# Altium schematic sheet AFE and MOSFETs.SchDoc
size A4; SheetNumber: 7; SheetTotal: 7
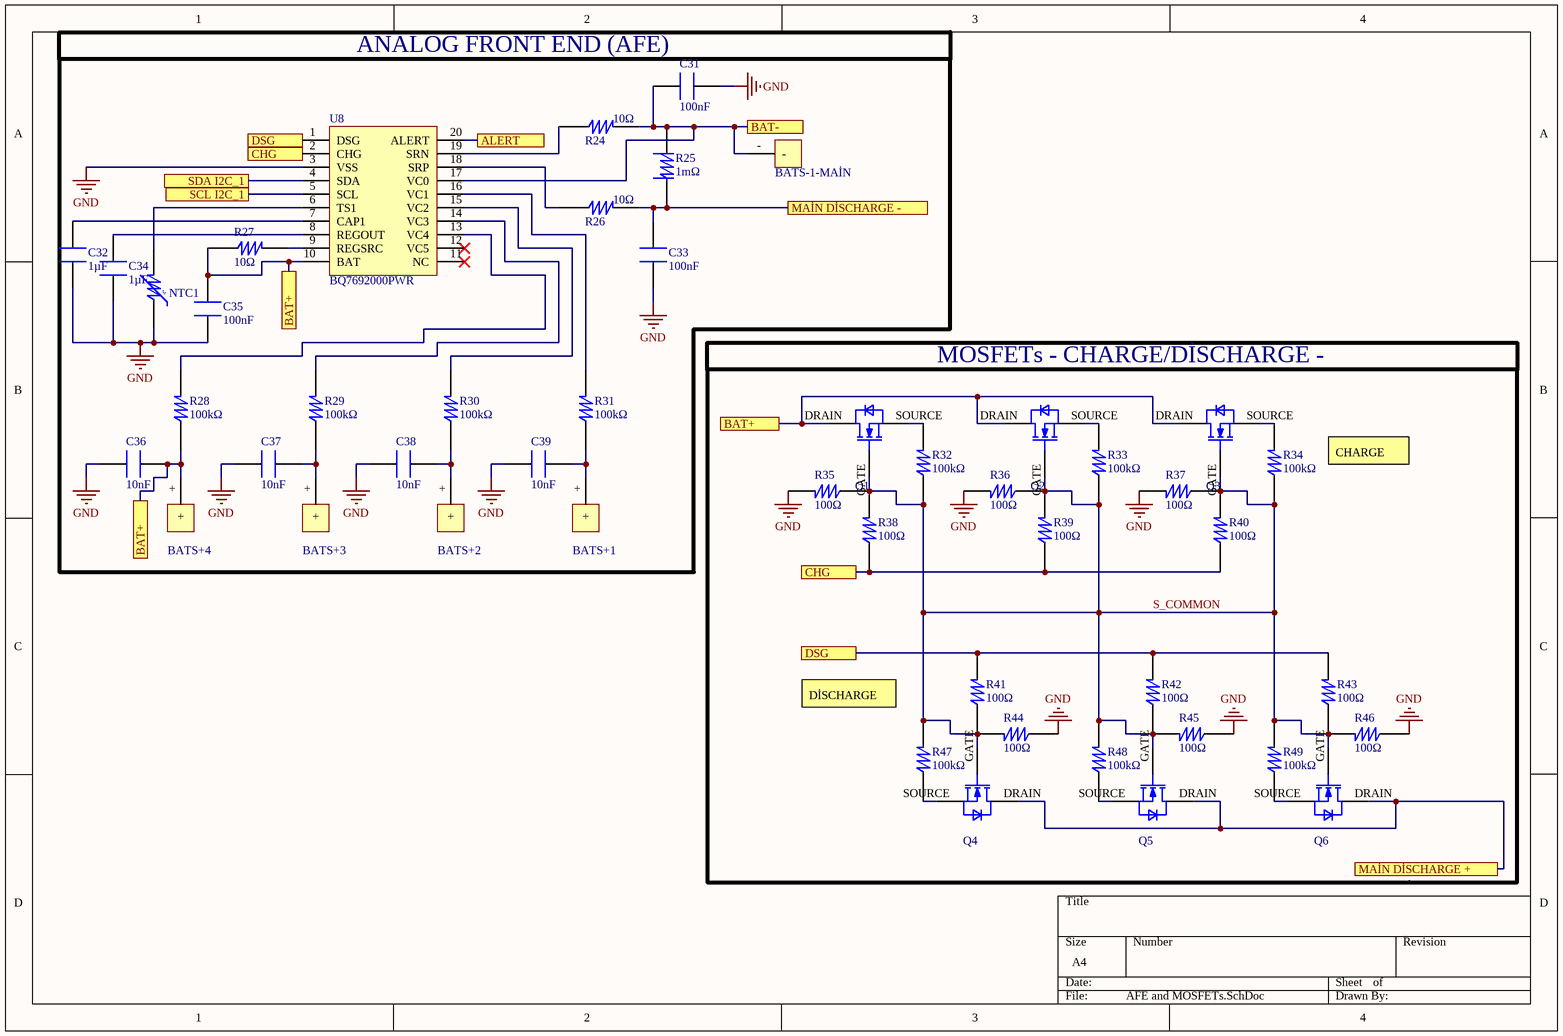
[diagram p0: AFE and MOSFETs.SchDoc]

## Parts
BATS+1  BATTERY + 1S  [BATTERY +1S]  (value not drawn)
BATS+2  BATTERY + 1S  [BATTERY +1S]  (value not drawn)
BATS+3  BATTERY + 1S  [BATTERY +1S]  (value not drawn)
BATS+4  BATTERY + 1S  [BATTERY +1S]  (value not drawn)
BATS-1-MAİN  BATTERY -1S  [BATTERY -1S]  (value not drawn)
C31  value 100nF  [CAP CER 0805]  (hidden comment: KGM21NR71H104KT)
C32  value 1µF  [CAP CER 0805]  (hidden comment: CL21B105KBFNNNE)
C33  value 100nF  [CAP CER 0805]  (hidden comment: KGM21NR71H104KT)
C34  value 1µF  [CAP CER 0805]  (hidden comment: CL21B105KBFNNNE)
C35  value 100nF  [CAP CER 0805]  (hidden comment: KGM21NR71H104KT)
C36  value 10nF  [CAP CER 0603]  (hidden comment: C0603C103J5RACTU)
C37  value 10nF  [CAP CER 0603]  (hidden comment: C0603C103J5RACTU)
C38  value 10nF  [CAP CER 0603]  (hidden comment: C0603C103J5RACTU)
C39  value 10nF  [CAP CER 0603]  (hidden comment: C0603C103J5RACTU)
NTC1  NC20KC0100KBA  [NTC 1206]  (value not drawn)
Q1  BSC010N04LSIATMA1  [8-PowerTDFN]  (value not drawn)
Q2  BSC010N04LSIATMA1  [8-PowerTDFN]  (value not drawn)
Q3  BSC010N04LSIATMA1  [8-PowerTDFN]  (value not drawn)
Q4  BSC010N04LSIATMA1  [8-PowerTDFN]  (value not drawn)
Q5  BSC010N04LSIATMA1  [8-PowerTDFN]  (value not drawn)
Q6  BSC010N04LSIATMA1  [8-PowerTDFN]  (value not drawn)
R24  value 10Ω  [RES 0603]  (hidden comment: RCP0603W10R0GEB)
R25  value 1mΩ  [Shunt 5931]  (hidden comment: SSA5931LR001FDR)
R26  value 10Ω  [RES 0603]  (hidden comment: RCP0603W10R0GEB)
R27  value 10Ω  [RES 0603]  (hidden comment: RT0603DRE0710RL)
R28  value 100kΩ  [RES 0603]  (hidden comment: RG1608P-104-B-T5)
R29  value 100kΩ  [RES 0603]  (hidden comment: RG1608P-104-B-T5)
R30  value 100kΩ  [RES 0603]  (hidden comment: RG1608P-104-B-T5)
R31  value 100kΩ  [RES 0603]  (hidden comment: RG1608P-104-B-T5)
R32  value 100kΩ  [RES 0603]  (hidden comment: RG1608P-104-B-T5)
R33  value 100kΩ  [RES 0603]  (hidden comment: RG1608P-104-B-T5)
R34  value 100kΩ  [RES 0603]  (hidden comment: RG1608P-104-B-T5)
R35  value 100Ω  [RES 0603]  (hidden comment: RG1608P-101-B-T5)
R36  value 100Ω  [RES 0603]  (hidden comment: RG1608P-101-B-T5)
R37  value 100Ω  [RES 0603]  (hidden comment: RG1608P-101-B-T5)
R38  value 100Ω  [RES 0603]  (hidden comment: RG1608P-101-B-T5)
R39  value 100Ω  [RES 0603]  (hidden comment: RG1608P-101-B-T5)
R40  value 100Ω  [RES 0603]  (hidden comment: RG1608P-101-B-T5)
R41  value 100Ω  [RES 0603]  (hidden comment: RG1608P-101-B-T5)
R42  value 100Ω  [RES 0603]  (hidden comment: RG1608P-101-B-T5)
R43  value 100Ω  [RES 0603]  (hidden comment: RG1608P-101-B-T5)
R44  value 100Ω  [RES 0603]  (hidden comment: RG1608P-101-B-T5)
R45  value 100Ω  [RES 0603]  (hidden comment: RG1608P-101-B-T5)
R46  value 100Ω  [RES 0603]  (hidden comment: RG1608P-101-B-T5)
R47  value 100kΩ  [RES 0603]  (hidden comment: RG1608P-104-B-T5)
R48  value 100kΩ  [RES 0603]  (hidden comment: RG1608P-104-B-T5)
R49  value 100kΩ  [RES 0603]  (hidden comment: RG1608P-104-B-T5)
U8  Supplier Part Number: BQ7692000PWR  [20-TSSOP]  (hidden comment: BQ7692000PW)

## Blocks framed on the sheet
ANALOG FRONT END (AFE): BATS+1-BATS+4 BATS-1-MAİN C31-C39 NTC1 R24-R31 U8
MOSFETs - CHARGE/DİSCHARGE -: Q1-Q6 R32-R49

## Ports
ALERT (see MCU[3A]), BAT+ (see AFE and MOSFETs[1B], AFE and MOSFETs[1C], Power[1C], Power[2A]), BAT+ (see AFE and MOSFETs[1B], AFE and MOSFETs[2B], Power[1C], Power[2A]), BAT+ (see AFE and MOSFETs[1C], AFE and MOSFETs[2B], Power[1C], Power[2A]), BAT- (see Power[1C]), CHG (see AFE and MOSFETs[1A]), CHG (see AFE and MOSFETs[3C]), DSG (see AFE and MOSFETs[1A]), DSG (see AFE and MOSFETs[3C]), MAİN DİSCHARGE + (see Power[1C]), MAİN DİSCHARGE - (see Power[1C]), SCL I2C_1 (see MCU[3B]), SDA I2C_1 (see MCU[2B])

## Nets
GND: C31.1 C32.2 C33.2 C34.2 C35.2 C36.1 C37.1 C38.1 C39.1 NTC1.1 R35.2 R36.2 R37.2 R44.1 R45.1 R46.1 U8.3(VSS)
ALERT: U8.20(ALERT) ; port ALERT
BAT+: BATS+4.+ C35.1 C36.2 Q1.DRAIN Q2.DRAIN Q3.DRAIN R27.1 R28.1 U8.10(BAT) ; port BAT+
BAT-: BATS-1-MAİN.- C31.2 R24.2 R25.2 U8.17(VC0) ; port BAT-
CHG: R38.1 R39.1 R40.1 U8.2(CHG) ; port CHG
DSG: R41.2 R42.2 R43.2 U8.1(DSG) ; port DSG
MAİN DİSCHARGE +: Q4.DRAIN Q5.DRAIN Q6.DRAIN ; port MAİN DİSCHARGE +
MAİN DİSCHARGE -: C33.1 R25.1 R26.2 ; port MAİN DİSCHARGE -
S_COMMON: Q1.GATE Q2.GATE Q3.GATE Q4.GATE Q5.GATE Q6.GATE R32.1 R33.1 R34.1 R35.1 R36.1 R37.1 R38.2 R39.2 R40.2 R41.1 R42.1 R43.1 R44.2 R45.2 R46.2 R47.2 R48.2 R49.2
SCL I2C_1: U8.5(SCL) ; port SCL I2C_1
SDA I2C_1: U8.4(SDA) ; port SDA I2C_1
NetBATS+1_+: BATS+1.+ C39.2 R31.1
NetBATS+2_+: BATS+2.+ C38.2 R30.1
NetBATS+3_+: BATS+3.+ C37.2 R29.1
NetC32_1: C32.1 U8.7(CAP1)
NetC34_1: C34.1 U8.8(REGOUT)
NetNTC1_2: NTC1.2 U8.6(TS1)
NetQ1_SOURCE: Q1.SOURCE R32.2
NetQ2_SOURCE: Q2.SOURCE R33.2
NetQ3_SOURCE: Q3.SOURCE R34.2
NetQ4_SOURCE: Q4.SOURCE R47.1
NetQ5_SOURCE: Q5.SOURCE R48.1
NetQ6_SOURCE: Q6.SOURCE R49.1
NetR24_1: R24.1 U8.19(SRN)
NetR26_1: R26.1 U8.18(SRP)
NetR27_2: R27.2 U8.9(REGSRC)
NetR28_2: R28.2 U8.13(VC4)
NetR29_2: R29.2 U8.14(VC3)
NetR30_2: R30.2 U8.15(VC2)
NetR31_2: R31.2 U8.16(VC1)

Not connected (* = marked no-connect by the designer): U8 11(NC)* 12(VC5)*

## Notes on the sheet
- CHARGE
- (near R47) DİSCHARGE
- (in symbol THERMISTOR NTC 10 OHM) -t°

## Library data of the parts
BATS+1-BATS+4 = BATTERY + 1S: battery + pad
BATS-1-MAİN = BATTERY -1S: battery - pad
C31 C33 C35 = CAP CER 0.1UF 50V 0805: 0.1 µF ±10% 50V Ceramic Capacitor X7R 0805 (2012 Metric); Manufacturer: KYOCERA AVX; Supplier: Arrow Electronics; Supplier Part Number: KGM21NR71H104KT; Manufacturer Part Number: KGM21NR71H104KT; RoHS: Compliant; Category: Ceramic Capacitors; Stock: 28652000; Pricing: 4000=0,0068, 20000=0,007, 100000=0,006 (USD); Dielectric Material: Ceramic; Height: 1mm; Length: 2.01mm; Lifecycle Status: Production; Max Operating Temperature: 125°C; Min Operating Temperature: -55°C; Mounting Technology: Surface Mount; Number of Terminals: 2; REACH SVHC: Yes; Voltage Rating (DC): 50V; Width: 1.25mm; ComponentLink1URL: https://datasheet.octopart.com:443/KGM21NR71H104KT-KYOCERA-AVX-datasheet-179280988.pdf?src-supplier=IHS; ComponentLink1Description: https://datasheet.octopart.com:443/KGM21NR71H104KT-KYOCERA-AVX-datasheet-179280988.pdf?src-supplier=IHS; ComponentLink2URL: https://datasheet.octopart.com:443/KGM21NR71H104KT-KYOCERA-AVX-datasheet-178027269.pdf?src-supplier=TME; ComponentLink2Description: https://datasheet.octopart.com:443/KGM21NR71H104KT-KYOCERA-AVX-datasheet-178027269.pdf?src-supplier=TME; ComponentLink3URL: https://datasheet.octopart.com:443/KGM21NR71H104KT-KYOCERA-AVX-datasheet-175509538.pdf?src-supplier=Future+Electronics; ComponentLink3Description: https://datasheet.octopart.com:443/KGM21NR71H104KT-KYOCERA-AVX-datasheet-175509538.pdf?src-supplier=Future+Electronics; ComponentLink4URL: http://sigma.octopart.com:80/conflict_mineral_statement/AVX-company-34.pdf?src-supplier=Compliance+Statements; ComponentLink4Description: http://sigma.octopart.com:80/conflict_mineral_statement/AVX-company-34.pdf?src-supplier=Compliance+Statements; ComponentLink5URL: http://sigma.octopart.com:80/reach_statement/AVX-company-19.pdf?src-supplier=Compliance+Statements; ComponentLink5Description: http://sigma.octopart.com:80/reach_statement/AVX-company-19.pdf?src-supplier=Compliance+Statements
C32 C34 = CAP CER 1UF 50V 0805: CAP CER 1UF 50V X7R 0805; Manufacturer: Samsung Electro-Mechanics; Dielectric Material: Ceramic; Tolerance: 10%; Supplier: Arrow Electronics; Supplier Part Number: CL21B105KBFNNNE; Manufacturer Part Number: CL21B105KBFNNNE; RoHS: Compliant; Category: Ceramic Capacitors; Stock: 4546000; Pricing: 10000=0,0106 (USD); Case/Package: 0805; Case Code (Imperial): 0805; Case Code (Metric): 2012; China RoHS: Compliant; Depth: 1.25mm; Dielectric: X7R; Height: 1.35mm; Length: 2mm; Lifecycle Status: Production; Material: Ceramic; Max Operating Temperature: 125°C; Min Operating Temperature: -55°C; Mounting Technology: Surface Mount; Number of Terminals: 2; Radiation Hardening: No; REACH SVHC: Yes; Schedule B: 8532240020, 8532240020|8532240020, 8532240020|8532240020|8532240020, 8532240020|8532240020|8532240020|8532240020; Thickness: 1.3462mm; Voltage: 50V; Voltage Rating: 50V; Voltage Rating (DC): 50V; Width: 1.25mm; ComponentLink1URL: https://datasheet.octopart.com:443/CL21B105KBFNNNE-Samsung-Electro-Mechanics-datasheet-136482495.pdf?src-supplier=IHS; ComponentLink1Description: https://datasheet.octopart.com:443/CL21B105KBFNNNE-Samsung-Electro-Mechanics-datasheet-136482495.pdf?src-supplier=IHS; ComponentLink2URL: https://datasheet.octopart.com:443/CL21B105KBFNNNE-Samsung-Electro-Mechanics-datasheet-11733377.pdf?src-supplier=Future+Electronics; ComponentLink2Description: https://datasheet.octopart.com:443/CL21B105KBFNNNE-Samsung-Electro-Mechanics-datasheet-11733377.pdf?src-supplier=Future+Electronics; ComponentLink3URL: https://datasheet.octopart.com:443/CL21B105KBFNNNE-Samsung-Electro-Mechanics-datasheet-116891038.pdf?src-supplier=Future+Electronics; ComponentLink3Description: https://datasheet.octopart.com:443/CL21B105KBFNNNE-Samsung-Electro-Mechanics-datasheet-116891038.pdf?src-supplier=Future+Electronics; ComponentLink4URL: https://datasheet.octopart.com:443/CL21B105KBFNNNE-Samsung-Electro-Mechanics-datasheet-81462183.pdf?src-supplier=Future+Electronics; ComponentLink4Description: https://datasheet.octopart.com:443/CL21B105KBFNNNE-Samsung-Electro-Mechanics-datasheet-81462183.pdf?src-supplier=Future+Electronics; ComponentLink5URL: https://datasheet.octopart.com:443/CL21B105KBFNNNE-Samsung-datasheet-48647582.pdf?src-supplier=Future+Electronics; ComponentLink5Description: https://datasheet.octopart.com:443/CL21B105KBFNNNE-Samsung-datasheet-48647582.pdf?src-supplier=Future+Electronics; ComponentLink6URL: https://datasheet.octopart.com:443/CL21B105KBFNNNE-Samsung-datasheet-8326294.pdf?src-supplier=Future+Electronics; ComponentLink6Description: https://datasheet.octopart.com:443/CL21B105KBFNNNE-Samsung-datasheet-8326294.pdf?src-supplier=Future+Electronics; ComponentLink7URL: https://datasheet.octopart.com:443/CL21B105KBFNNNE-Samsung-Electro-Mechanics-datasheet-149045959.pdf?src-supplier=Future+Electronics; ComponentLink7Description: https://datasheet.octopart.com:443/CL21B105KBFNNNE-Samsung-Electro-Mechanics-datasheet-149045959.pdf?src-supplier=Future+Electronics; ComponentLink8URL: https://datasheet.octopart.com/CL21B105KBFNNNE-Samsung-Electro-Mechanics-datasheet-97040617.pdf; ComponentLink8Description: https://datasheet.octopart.com/CL21B105KBFNNNE-Samsung-Electro-Mechanics-datasheet-97040617.pdf; ComponentLink9URL: https://datasheet.octopart.com/CL21B105KBFNNNE-Samsung-Electro-Mechanics-datasheet-8324245.pdf; ComponentLink9Description: https://datasheet.octopart.com/CL21B105KBFNNNE-Samsung-Electro-Mechanics-datasheet-8324245.pdf; ComponentLink10URL: https://datasheet.octopart.com/General-Multilayer-Ceramic-Capacitors-Samsung-datasheet-family-111.pdf; ComponentLink10Description: https://datasheet.octopart.com/General-Multilayer-Ceramic-Capacitors-Samsung-datasheet-family-111.pdf; ComponentLink11URL: https://datasheet.octopart.com:443/CL21B105KBFNNNE-Samsung-datasheet-59220082.pdf?src-supplier=TME; ComponentLink11Description: https://datasheet.octopart.com:443/CL21B105KBFNNNE-Samsung-datasheet-59220082.pdf?src-supplier=TME; ComponentLink12URL: http://sigma.octopart.com:80/rohs_certificate/General-Multilayer-Ceramic-Capacitors-Samsung-family-110.pdf?src-supplier=Compliance+Statements; ComponentLink12Description: http://sigma.octopart.com:80/rohs_certificate/General-Multilayer-Ceramic-Capacitors-Samsung-family-110.pdf?src-supplier=Compliance+Statements; ComponentLink13URL: http://sigma.octopart.com:80/rohs_statement/General-Multilayer-Ceramic-Capacitors-Samsung-family-132.pdf?src-supplier=Compliance+Statements; ComponentLink13Description: http://sigma.octopart.com:80/rohs_statement/General-Multilayer-Ceramic-Capacitors-Samsung-family-132.pdf?src-supplier=Compliance+Statements; ComponentLink14URL: http://sigma.octopart.com:80/reach_statement/General-Multilayer-Ceramic-Capacitors-Samsung-family-133.pdf?src-supplier=Compliance+Statements; ComponentLink14Description: http://sigma.octopart.com:80/reach_statement/General-Multilayer-Ceramic-Capacitors-Samsung-family-133.pdf?src-supplier=Compliance+Statements
C36-C39 = CAP CER 0.01µF (10 nF) 50V 0603: CAP CER 10000PF 50V X7R 0603; Manufacturer: KEMET; Dielectric Material: Ceramic; Dissipation Factor: 2.5%; Temperature Coefficient: 30ppm/°C; Tolerance: 5%; Supplier: Arrow Electronics; Supplier Part Number: C0603C103J5RACTU; Manufacturer Part Number: C0603C103J5RACTU; RoHS: Compliant; Category: Ceramic Capacitors; Stock: 896000; Pricing: 20000=0,0043 (USD); Case/Package: 0603; Case Code (Imperial): 0603; China RoHS: Compliant; Contact Plating: Tin; Depth: 800µm; Dielectric: X7R; Height: 800µm; Lead Free: Lead Free; Lead Pitch: 700µm; Length: 1.6mm; Lifecycle Status: Production; Material: Ceramic; Max Operating Temperature: 125°C; Min Operating Temperature: -55°C; Mounting Technology: Surface Mount; Pins: 2; Number of Terminals: 2; Packaging: Cut Tape; Radiation Hardening: No; REACH SVHC: Yes; Schedule B: 8532240020, 8532240020|8532240020, 8532240020|8532240020|8532240020, 8532240020|8532240020|8532240020|8532240020; Termination: SMD/SMT; Thickness: 863.6µm; Voltage: 50V; Voltage Rating: 50V; Voltage Rating (DC): 50V; Width: 800µm; ComponentLink1URL: https://datasheet.octopart.com:443/C0603C103J5RAC7867-KEMET-datasheet-179096189.pdf?src-supplier=IHS; ComponentLink1Description: https://datasheet.octopart.com:443/C0603C103J5RAC7867-KEMET-datasheet-179096189.pdf?src-supplier=IHS; ComponentLink2URL: https://datasheet.octopart.com:443/C0603C103J5RACTU-KEMET-datasheet-178445679.pdf?src-supplier=IHS; ComponentLink2Description: https://datasheet.octopart.com:443/C0603C103J5RACTU-KEMET-datasheet-178445679.pdf?src-supplier=IHS; ComponentLink3URL: https://datasheet.octopart.com:443/C0603C103J5RACTU-KEMET-datasheet-137357759.pdf?src-supplier=Upverter; ComponentLink3Description: https://datasheet.octopart.com:443/C0603C103J5RACTU-KEMET-datasheet-137357759.pdf?src-supplier=Upverter; ComponentLink4URL: https://datasheet.octopart.com:443/C0603C103J5RACTU-KEMET-datasheet-137357764.pdf?src-supplier=Upverter; ComponentLink4Description: https://datasheet.octopart.com:443/C0603C103J5RACTU-KEMET-datasheet-137357764.pdf?src-supplier=Upverter; ComponentLink5URL: https://datasheet.octopart.com:443/C0603C103J5RAC-TU-Kemet-datasheet-5313890.pdf?src-supplier=Newark; ComponentLink5Description: https://datasheet.octopart.com:443/C0603C103J5RAC-TU-Kemet-datasheet-5313890.pdf?src-supplier=Newark; ComponentLink6URL: https://datasheet.octopart.com:443/C0603C103J5RAC-TU-Kemet-datasheet-5390537.pdf?src-supplier=Newark; ComponentLink6Description: https://datasheet.octopart.com:443/C0603C103J5RAC-TU-Kemet-datasheet-5390537.pdf?src-supplier=Newark; ComponentLink7URL: https://datasheet.octopart.com:443/C0603C103J5RAC-TU-Kemet-datasheet-7541751.pdf?src-supplier=Newark; ComponentLink7Description: https://datasheet.octopart.com:443/C0603C103J5RAC-TU-Kemet-datasheet-7541751.pdf?src-supplier=Newark; ComponentLink8URL: https://datasheet.octopart.com:443/C0603C103J5RACTU-KEMET-datasheet-176289383.pdf?src-supplier=Newark; ComponentLink8Description: https://datasheet.octopart.com:443/C0603C103J5RACTU-KEMET-datasheet-176289383.pdf?src-supplier=Newark; ComponentLink9URL: https://datasheet.octopart.com:443/C0603C103J5RACTU-KEMET-datasheet-130256537.pdf?src-supplier=Newark; ComponentLink9Description: https://datasheet.octopart.com:443/C0603C103J5RACTU-KEMET-datasheet-130256537.pdf?src-supplier=Newark; ComponentLink10URL: https://datasheet.octopart.com:443/C0603C103J5RACTU-Kemet-datasheet-8764837.pdf?src-supplier=Newark; ComponentLink10Description: https://datasheet.octopart.com:443/C0603C103J5RACTU-Kemet-datasheet-8764837.pdf?src-supplier=Newark; ComponentLink11URL: https://datasheet.octopart.com:443/C0603C103J5RACTU-Kemet-datasheet-8480123.pdf?src-supplier=Newark; ComponentLink11Description: https://datasheet.octopart.com:443/C0603C103J5RACTU-Kemet-datasheet-8480123.pdf?src-supplier=Newark; ComponentLink12URL: https://datasheet.octopart.com:443/C0603C103J5RACTU-Kemet-datasheet-5393970.pdf?src-supplier=Newark; ComponentLink12Description: https://datasheet.octopart.com:443/C0603C103J5RACTU-Kemet-datasheet-5393970.pdf?src-supplier=Newark; ComponentLink13URL: https://datasheet.octopart.com:443/C0603C103J5RACTU-Kemet-datasheet-8502025.pdf?src-supplier=Newark; ComponentLink13Description: https://datasheet.octopart.com:443/C0603C103J5RACTU-Kemet-datasheet-8502025.pdf?src-supplier=Newark; ComponentLink14URL: https://datasheet.octopart.com:443/C0603C103J5RACTU-Kemet-datasheet-161801.pdf?src-supplier=Newark; ComponentLink14Description: https://datasheet.octopart.com:443/C0603C103J5RACTU-Kemet-datasheet-161801.pdf?src-supplier=Newark; ComponentLink15URL: https://datasheet.octopart.com:443/C0603C103J5RACTU-KEMET-datasheet-149521810.pdf?src-supplier=Farnell; ComponentLink15Description: https://datasheet.octopart.com:443/C0603C103J5RACTU-KEMET-datasheet-149521810.pdf?src-supplier=Farnell; ComponentLink16URL: https://datasheet.octopart.com:443/C0603C103J5RACTU-Kemet-datasheet-12608295.pdf?src-supplier=Farnell; ComponentLink16Description: https://datasheet.octopart.com:443/C0603C103J5RACTU-Kemet-datasheet-12608295.pdf?src-supplier=Farnell; ComponentLink17URL: https://datasheet.octopart.com:443/C0603C103J5RACTU-Kemet-datasheet-11992184.pdf?src-supplier=Farnell; ComponentLink17Description: https://datasheet.octopart.com:443/C0603C103J5RACTU-Kemet-datasheet-11992184.pdf?src-supplier=Farnell; ComponentLink18URL: https://datasheet.octopart.com:443/C0603C103J5RACTU-Kemet-datasheet-10942409.pdf?src-supplier=Farnell; ComponentLink18Description: https://datasheet.octopart.com:443/C0603C103J5RACTU-Kemet-datasheet-10942409.pdf?src-supplier=Farnell; ComponentLink19URL: https://datasheet.octopart.com:443/C0603C103J5RACTU-Kemet-datasheet-10404442.pdf?src-supplier=Farnell; ComponentLink19Description: https://datasheet.octopart.com:443/C0603C103J5RACTU-Kemet-datasheet-10404442.pdf?src-supplier=Farnell; ComponentLink20URL: https://datasheet.octopart.com:443/C0603C103J5RACTU-KEMET-datasheet-101575638.pdf?src-supplier=Farnell; ComponentLink20Description: https://datasheet.octopart.com:443/C0603C103J5RACTU-KEMET-datasheet-101575638.pdf?src-supplier=Farnell; ComponentLink21URL: https://datasheet.octopart.com:443/C0603C103J5RAC-TU-Kemet-datasheet-7833651.pdf?src-supplier=Farnell; ComponentLink21Description: https://datasheet.octopart.com:443/C0603C103J5RAC-TU-Kemet-datasheet-7833651.pdf?src-supplier=Farnell; ComponentLink22URL: https://datasheet.octopart.com:443/C0603C103J5RAC-TU-Kemet-datasheet-7601896.pdf?src-supplier=Farnell; ComponentLink22Description: https://datasheet.octopart.com:443/C0603C103J5RAC-TU-Kemet-datasheet-7601896.pdf?src-supplier=Farnell; ComponentLink23URL: https://datasheet.octopart.com:443/C0603C103J5RAC-TU-Kemet-datasheet-5316294.pdf?src-supplier=Farnell; ComponentLink23Description: https://datasheet.octopart.com:443/C0603C103J5RAC-TU-Kemet-datasheet-5316294.pdf?src-supplier=Farnell; ComponentLink24URL: https://datasheet.octopart.com:443/C0603C103J5RAC-TU-Kemet-datasheet-5314837.pdf?src-supplier=Farnell; ComponentLink24Description: https://datasheet.octopart.com:443/C0603C103J5RAC-TU-Kemet-datasheet-5314837.pdf?src-supplier=Farnell; ComponentLink25URL: https://datasheet.octopart.com:443/C0603C103J5RAC-TU-Kemet-datasheet-8092359.pdf?src-supplier=Farnell; ComponentLink25Description: https://datasheet.octopart.com:443/C0603C103J5RAC-TU-Kemet-datasheet-8092359.pdf?src-supplier=Farnell; ComponentLink26URL: https://datasheet.octopart.com:443/C0603C103J5RAC-TU-Kemet-datasheet-5314449.pdf?src-supplier=Farnell; ComponentLink26Description: https://datasheet.octopart.com:443/C0603C103J5RAC-TU-Kemet-datasheet-5314449.pdf?src-supplier=Farnell; ComponentLink27URL: https://datasheet.octopart.com:443/C0603C103J5RAC-TU-Kemet-datasheet-5314969.pdf?src-supplier=Farnell; ComponentLink27Description: https://datasheet.octopart.com:443/C0603C103J5RAC-TU-Kemet-datasheet-5314969.pdf?src-supplier=Farnell; ComponentLink28URL: https://datasheet.octopart.com:443/C0603C103J5RAC-TU-Kemet-datasheet-5314627.pdf?src-supplier=Farnell; ComponentLink28Description: https://datasheet.octopart.com:443/C0603C103J5RAC-TU-Kemet-datasheet-5314627.pdf?src-supplier=Farnell; ComponentLink29URL: https://datasheet.octopart.com:443/C0603C103J5RAC-TU-Kemet-datasheet-5389132.pdf?src-supplier=Farnell; ComponentLink29Description: https://datasheet.octopart.com:443/C0603C103J5RAC-TU-Kemet-datasheet-5389132.pdf?src-supplier=Farnell; ComponentLink30URL: https://datasheet.octopart.com:443/C0603C103J5RAC-TU-Kemet-datasheet-5313836.pdf?src-supplier=Farnell; ComponentLink30Description: https://datasheet.octopart.com:443/C0603C103J5RAC-TU-Kemet-datasheet-5313836.pdf?src-supplier=Farnell; ComponentLink31URL: https://datasheet.octopart.com:443/C0603C103J5RAC-TU-Kemet-datasheet-8111010.pdf?src-supplier=Farnell; ComponentLink31Description: https://datasheet.octopart.com:443/C0603C103J5RAC-TU-Kemet-datasheet-8111010.pdf?src-supplier=Farnell; ComponentLink32URL: https://datasheet.octopart.com:443/C0603C103J5RAC-TU-Kemet-datasheet-7627733.pdf?src-supplier=Farnell; ComponentLink32Description: https://datasheet.octopart.com:443/C0603C103J5RAC-TU-Kemet-datasheet-7627733.pdf?src-supplier=Farnell; ComponentLink33URL: https://datasheet.octopart.com:443/C0603C103J5RAC-TU-Kemet-datasheet-5315946.pdf?src-supplier=Farnell; ComponentLink33Description: https://datasheet.octopart.com:443/C0603C103J5RAC-TU-Kemet-datasheet-5315946.pdf?src-supplier=Farnell; ComponentLink34URL: https://datasheet.octopart.com:443/C0603C103J5RACTU-Kemet-datasheet-32036385.pdf?src-supplier=Electro+Sonic; ComponentLink34Description: https://datasheet.octopart.com:443/C0603C103J5RACTU-Kemet-datasheet-32036385.pdf?src-supplier=Electro+Sonic; ComponentLink35URL: https://datasheet.octopart.com:443/C0603C103J5RACTU-KEMET-datasheet-157246124.pdf?src-supplier=Electro+Sonic; ComponentLink35Description: https://datasheet.octopart.com:443/C0603C103J5RACTU-KEMET-datasheet-157246124.pdf?src-supplier=Electro+Sonic; ComponentLink36URL: https://datasheet.octopart.com:443/C0603C103J5RACTU-KEMET-datasheet-164512540.pdf?src-supplier=TME; ComponentLink36Description: https://datasheet.octopart.com:443/C0603C103J5RACTU-KEMET-datasheet-164512540.pdf?src-supplier=TME; ComponentLink37URL: https://datasheet.octopart.com:443/C0603C103J5RACTU-KEMET-datasheet-96931484.pdf?src-supplier=TME; ComponentLink37Description: https://datasheet.octopart.com:443/C0603C103J5RACTU-KEMET-datasheet-96931484.pdf?src-supplier=TME; ComponentLink38URL: https://datasheet.octopart.com:443/C0603C103J5RACTU-KEMET-datasheet-68331906.pdf?src-supplier=TME; ComponentLink38Description: https://datasheet.octopart.com:443/C0603C103J5RACTU-KEMET-datasheet-68331906.pdf?src-supplier=TME; ComponentLink39URL: https://datasheet.octopart.com:443/C0603C103J5RACTU-KEMET-datasheet-160663178.pdf?src-supplier=JRH+Electronics; ComponentLink39Description: https://datasheet.octopart.com:443/C0603C103J5RACTU-KEMET-datasheet-160663178.pdf?src-supplier=JRH+Electronics; ComponentLink40URL: https://datasheet.octopart.com:443/C0603C103J5RACTU-KEMET-datasheet-110724412.pdf?src-supplier=RS+(Formerly+Allied+Electronics); ComponentLink40Description: https://datasheet.octopart.com:443/C0603C103J5RACTU-KEMET-datasheet-110724412.pdf?src-supplier=RS+(Formerly+Allied+Electronics); ComponentLink41URL: https://datasheet.octopart.com:443/C0603C103J5RACTU-Kemet-datasheet-464.pdf?src-supplier=RS+(Formerly+Allied+Electronics); ComponentLink41Description: https://datasheet.octopart.com:443/C0603C103J5RACTU-Kemet-datasheet-464.pdf?src-supplier=RS+(Formerly+Allied+Electronics); ComponentLink42URL: https://datasheet.octopart.com/C0603C103J5RACTU-KEMET-datasheet-84169754.pdf; ComponentLink42Description: https://datasheet.octopart.com/C0603C103J5RACTU-KEMET-datasheet-84169754.pdf; ComponentLink43URL: https://datasheet.octopart.com:443/C0603C103J5RACTU-Kemet-datasheet-24570007.pdf?src-supplier=element14+APAC; ComponentLink43Description: https://datasheet.octopart.com:443/C0603C103J5RACTU-Kemet-datasheet-24570007.pdf?src-supplier=element14+APAC; ComponentLink44URL: https://datasheet.octopart.com:443/C0603C103J5RACTU-Kemet-datasheet-22084244.pdf?src-supplier=element14+APAC; ComponentLink44Description: https://datasheet.octopart.com:443/C0603C103J5RACTU-Kemet-datasheet-22084244.pdf?src-supplier=element14+APAC; ComponentLink45URL: https://datasheet.octopart.com:443/C0603C103J5RACTU-Kemet-datasheet-11807495.pdf?src-supplier=Arrow+Electronics; ComponentLink45Description: https://datasheet.octopart.com:443/C0603C103J5RACTU-Kemet-datasheet-11807495.pdf?src-supplier=Arrow+Electronics; ComponentLink46URL: https://datasheet.octopart.com:443/C0603C103J5RAC-TU-Kemet-datasheet-7275486.pdf?src-supplier=Jameco; ComponentLink46Description: https://datasheet.octopart.com:443/C0603C103J5RAC-TU-Kemet-datasheet-7275486.pdf?src-supplier=Jameco
NTC1 = THERMISTOR NTC 10 OHM: NTC Thermistor 10 1206 (3216 Metric); Manufacturer: KYOCERA AVX; Accuracy: 5%; Max Power Dissipation: 240mW; Value: 10Ω NTC; Tolerance: 10%; Supplier: Mouser; Supplier Part Number: 581-NC20KC0100KBA; Manufacturer Part Number: NC20KC0100KBA; RoHS: Compliant; Category: Thermistors; Stock: 13105; Pricing: 1=0,43, 10=0,405, 50=0,359, 100=0,342, 1000=0,295, 10000=0,282 (USD); Case/Package: 1206; Case Code (Imperial): 1206; Case Code (Metric): 3216; China RoHS: Compliant; Depth: 1.6mm; Height: 1.5mm; Lead Free: Contains Lead; Length: 3.2mm; Lifecycle Status: Production; Max Operating Temperature: 150°C; Min Operating Temperature: -55°C; Mounting Technology: Surface Mount; Pins: 2; Number of Terminals: 2; Power Dissipation: 240mW; Power Rating: 240mW; Radiation Hardening: No; REACH SVHC: Yes; Schedule B: 8533400080; Termination: SMD/SMT; Width: 1.6mm; ComponentLink1URL: https://datasheet.octopart.com:443/NC20KC0100KBA-KYOCERA-AVX-datasheet-182025368.pdf?src-supplier=IHS; ComponentLink1Description: https://datasheet.octopart.com:443/NC20KC0100KBA-KYOCERA-AVX-datasheet-182025368.pdf?src-supplier=IHS; ComponentLink2URL: https://datasheet.octopart.com:443/NC20KC0100KBA-AVX-datasheet-2691.pdf?src-supplier=Mouser; ComponentLink2Description: https://datasheet.octopart.com:443/NC20KC0100KBA-AVX-datasheet-2691.pdf?src-supplier=Mouser; ComponentLink3URL: https://datasheet.octopart.com:443/NC20KC0100KBA-AVX-datasheet-12341000.pdf?src-supplier=_legacy+Avnet; ComponentLink3Description: https://datasheet.octopart.com:443/NC20KC0100KBA-AVX-datasheet-12341000.pdf?src-supplier=_legacy+Avnet; ComponentLink4URL: http://sigma.octopart.com:80/conflict_mineral_statement/AVX-company-34.pdf?src-supplier=Compliance+Statements; ComponentLink4Description: http://sigma.octopart.com:80/conflict_mineral_statement/AVX-company-34.pdf?src-supplier=Compliance+Statements; ComponentLink5URL: http://sigma.octopart.com:80/reach_statement/AVX-company-19.pdf?src-supplier=Compliance+Statements; ComponentLink5Description: http://sigma.octopart.com:80/reach_statement/AVX-company-19.pdf?src-supplier=Compliance+Statements
Q1-Q6 = MOSFET N-CH 40V 37A/100A: N-Channel 40 V 37A (Ta), 100A (Tc) 2.5W (Ta), 139W (Tc) Surface Mount PG-TDSON-8 FL; Manufacturer: Infineon; Drain to Source Breakdown Voltage: 40V; Drain to Source Resistance: 1.4mΩ; Fall Time: 17ns; Gate to Source Voltage (Vgs): 20V; Input Capacitance: 6.2nF; Max Junction Temperature (Tj): 150°C; Number of Channels: 1; On-State Resistance: 1.05mΩ; Rise Time: 48ns; Turn-Off Delay Time: 33ns; Turn-On Delay Time: 9ns; Supplier: Farnell; Supplier Part Number: 2725801; Manufacturer Part Number: BSC010N04LSIATMA1; RoHS: Compliant; Category: MOSFETs; Stock: 11576; Pricing: 1=1,27, 10=1,13, 100=1,12, 500=0,92, 1000=0,818 (EUR); China RoHS: Non-Compliant; Continuous Drain Current (ID): 37A; Drain to Source Voltage (Vdss): 40V; Halogen Free: Halogen Free; Height: 1.1mm; Lead Free: Contains Lead; Lifecycle Status: Production; Max Dual Supply Voltage: 40V; Max Operating Temperature: 150°C; Max Power Dissipation: 139W; Min Breakdown Voltage: 40V; Min Operating Temperature: -55°C; Mounting Technology: Surface Mount; Number of Elements: 1; Pins: 8; Number of Terminals: 8; Package Quantity: 5000; Packaging: Tape & Reel; Power Dissipation: 2.5W; Rds On Max: 1.05mΩ; REACH SVHC: No; Schedule B: 8541290080, 8541290080|8541290080|8541290080|8541290080|8541290080|8541290080|8541290080|8541290080|8541290080|8541290080|8541290080|8541290080|8541290080|8541290080|8541290080|8541290080|8541290080|8541290080|8541290080|8541290080|8541290080|8541290080|8541290080|85; ComponentLink1URL: https://datasheet.octopart.com:443/BSC010N04LSIATMA1-Infineon-datasheet-82520598.pdf?src-supplier=ODG+(Origin+Data+Global); ComponentLink1Description: https://datasheet.octopart.com:443/BSC010N04LSIATMA1-Infineon-datasheet-82520598.pdf?src-supplier=ODG+(Origin+Data+Global); ComponentLink2URL: https://datasheet.octopart.com:443/BSC010N04LSIATMA1-Infineon-datasheet-62293607.pdf?src-supplier=TME; ComponentLink2Description: https://datasheet.octopart.com:443/BSC010N04LSIATMA1-Infineon-datasheet-62293607.pdf?src-supplier=TME; ComponentLink3URL: http://sigma.octopart.com:80/conflict_mineral_statement/Infineon-company-51.pdf?src-supplier=Compliance+Statements; ComponentLink3Description: http://sigma.octopart.com:80/conflict_mineral_statement/Infineon-company-51.pdf?src-supplier=Compliance+Statements
R24 R26 = RES 10 OHM 1.5W 0603: 10 Ohms ±2% 1.5W Chip Resistor 0603 (1608 Metric) Moisture Resistant Thick Film; Manufacturer: Vishay; Max Power Dissipation: 3.9W; Temperature Coefficient: 150ppm/°C; Working Voltage: 3.873V; Supplier: Arrow Electronics; Supplier Part Number: RCP0603W10R0GEB; Manufacturer Part Number: RCP0603W10R0GEB; RoHS: Compliant; Category: Chip SMD Resistors; Pricing: 1000=1,5971 (USD); Case/Package: 0603; Composition: Thick Film; Features: Moisture Resistant; Height: 460µm; Length: 1.6002mm; Lifecycle Status: Production; Max Operating Temperature: 155°C; Min Operating Temperature: -65°C; Mounting Technology: Surface Mount; Number of Terminals: 2; Number of Terminations: 2; Power Dissipation: 1.5W; Power Rating: 1.5W; Tolerance: 2%; Width: 810µm; ComponentLink1URL: https://datasheet.octopart.com:443/RCP0603W10R0GEB-Vishay-datasheet-182028431.pdf?src-supplier=IHS; ComponentLink1Description: https://datasheet.octopart.com:443/RCP0603W10R0GEB-Vishay-datasheet-182028431.pdf?src-supplier=IHS; ComponentLink2URL: https://datasheet.octopart.com:443/RCP0603W10R0GEB-Vishay-datasheet-152607319.pdf?src-supplier=Upverter; ComponentLink2Description: https://datasheet.octopart.com:443/RCP0603W10R0GEB-Vishay-datasheet-152607319.pdf?src-supplier=Upverter; ComponentLink3URL: http://sigma.octopart.com:80/rohs_statement/Vishay-company-15.pdf?src-supplier=Compliance+Statements; ComponentLink3Description: http://sigma.octopart.com:80/rohs_statement/Vishay-company-15.pdf?src-supplier=Compliance+Statements
R25 = RES SHUNT 1 mOHM 10W: 10W Chip Resistor Nonstandard Current Sense, High Voltage Metal Element; Manufacturer: Littelfuse; Temperature Coefficient: 50ppm/°C; Tolerance: 1%; Supplier: Mouser; Supplier Part Number: 576-SSA5931LR001FDR; Manufacturer Part Number: SSA5931LR001FDR; RoHS: Compliant; Category: Chip SMD Resistors; Stock: 1410; Pricing: 1=1,96, 10=1,3, 50=1,01, 100=0,909, 1000=0,677, 10000=0,611 (USD); Height: 500µm; Lifecycle Status: Production; Max Operating Temperature: 170°C; Min Operating Temperature: -55°C; Mounting Technology: Surface Mount; Number of Terminals: 2; Power Dissipation: 10W; Width: 7.75mm; ComponentLink1URL: https://datasheet.octopart.com:443/SSA5931LR001FDR-Littelfuse-datasheet-182144187.pdf?src-supplier=IHS; ComponentLink1Description: https://datasheet.octopart.com:443/SSA5931LR001FDR-Littelfuse-datasheet-182144187.pdf?src-supplier=IHS
R27 = RES 10 OHM 1/10W 0603: 10 Ohms ±0.5% 0.1W, 1/10W Chip Resistor 0603 (1608 Metric) Thin Film; Manufacturer: Yageo Group; Max Power Dissipation: 100mW; Temperature Coefficient: 50ppm/°C; Voltage Rating: 75V; Voltage Rating (DC): 50V; Supplier: Farnell; Supplier Part Number: 4013877; Manufacturer Part Number: RT0603DRE0710RL; RoHS: Compliant; Category: Chip SMD Resistors; Stock: 4780; Pricing: 10=0,0244, 100=0,018, 500=0,0165, 1000=0,015, 2500=0,0135, 5000=0,012 (EUR); Case/Package: 0603; Case Code (Imperial): 0603; China RoHS: Non-Compliant; Composition: Thin Film; Contact Plating: Tin; Features: Moisture Resistant; Height: 450µm; Lead Free: Lead Free; Length: 1.6002mm; Lifecycle Status: Production; Max Operating Temperature: 155°C; Min Operating Temperature: -55°C; Mounting Technology: Surface Mount; Number of Terminals: 2; Number of Terminations: 2; Packaging: Tape & Reel (TR); Power Dissipation: 100mW; Power Rating: 100mW; Radiation Hardening: No; REACH SVHC: Yes; Tolerance: 0.5%; Width: 800µm; Working Voltage: 75V; ComponentLink1URL: https://datasheet.octopart.com:443/RT0603DRE0710RL-Yageo-datasheet-176402239.pdf?src-supplier=Newark; ComponentLink1Description: https://datasheet.octopart.com:443/RT0603DRE0710RL-Yageo-datasheet-176402239.pdf?src-supplier=Newark; ComponentLink2URL: https://datasheet.octopart.com:443/RT0603DRE0710RL-Yageo-datasheet-96443642.pdf?src-supplier=Upverter; ComponentLink2Description: https://datasheet.octopart.com:443/RT0603DRE0710RL-Yageo-datasheet-96443642.pdf?src-supplier=Upverter; ComponentLink3URL: https://datasheet.octopart.com:443/RT0603DRE0710RL-Yageo-datasheet-169971040.pdf?src-supplier=Future+Electronics; ComponentLink3Description: https://datasheet.octopart.com:443/RT0603DRE0710RL-Yageo-datasheet-169971040.pdf?src-supplier=Future+Electronics; ComponentLink4URL: https://datasheet.octopart.com:443/RT0603DRE0710RL-Yageo-datasheet-166250672.pdf?src-supplier=Future+Electronics; ComponentLink4Description: https://datasheet.octopart.com:443/RT0603DRE0710RL-Yageo-datasheet-166250672.pdf?src-supplier=Future+Electronics; ComponentLink5URL: https://datasheet.octopart.com:443/RT0603DRE0710RL-Yageo-datasheet-136673517.pdf?src-supplier=Future+Electronics; ComponentLink5Description: https://datasheet.octopart.com:443/RT0603DRE0710RL-Yageo-datasheet-136673517.pdf?src-supplier=Future+Electronics; ComponentLink6URL: https://datasheet.octopart.com:443/RT0603DRE0710RL-Yageo-datasheet-137700930.pdf?src-supplier=Future+Electronics; ComponentLink6Description: https://datasheet.octopart.com:443/RT0603DRE0710RL-Yageo-datasheet-137700930.pdf?src-supplier=Future+Electronics; ComponentLink7URL: https://datasheet.octopart.com:443/RT0603DRE0710RL-Yageo-Group-datasheet-141265893.pdf?src-supplier=ODG+(Origin+Data+Global); ComponentLink7Description: https://datasheet.octopart.com:443/RT0603DRE0710RL-Yageo-Group-datasheet-141265893.pdf?src-supplier=ODG+(Origin+Data+Global); ComponentLink8URL: https://datasheet.octopart.com/RT0603DRE0710RL-Yageo-datasheet-86813807.pdf; ComponentLink8Description: https://datasheet.octopart.com/RT0603DRE0710RL-Yageo-datasheet-86813807.pdf; ComponentLink9URL: http://sigma.octopart.com:80/conflict_mineral_statement/Yageo-company-3.pdf?src-supplier=Compliance+Statements; ComponentLink9Description: http://sigma.octopart.com:80/conflict_mineral_statement/Yageo-company-3.pdf?src-supplier=Compliance+Statements; ComponentLink10URL: http://sigma.octopart.com:80/rohs_statement/Yageo-company-2.pdf?src-supplier=Compliance+Statements; ComponentLink10Description: http://sigma.octopart.com:80/rohs_statement/Yageo-company-2.pdf?src-supplier=Compliance+Statements
R28-R34 R47-R49 = RES 100K OHM 1/10W 0603: 100 kOhms ±0.1% 0.1W, 1/10W Chip Resistor 0603 (1608 Metric) Anti-Sulfur, Automotive AEC-Q200 Thin Film; Manufacturer: Susumu; Max Power Dissipation: 100mW; Temperature Coefficient: 10ppm/°C; Voltage Rating: 100V; Voltage Rating (DC): 75V; Supplier: Future Electronics; Supplier Part Number: 2180081; Manufacturer Part Number: RG1608P-104-B-T5; RoHS: Compliant; Category: Chip SMD Resistors; Stock: 50000; Pricing: 5000=0,0575, 10000=0,0565, 15000=0,0559, 20000=0,0556, 25000=0,0543 (USD); Case/Package: 0603; Case Code (Imperial): 0603; Case Code (Metric): 1608; Composition: Thin Film; Features: Automotive AEC-Q200; Height: 400µm; Lead Free: Lead Free; Length: 1.6002mm; Lifecycle Status: Production; Max Operating Temperature: 155°C; Min Operating Temperature: -55°C; Mounting Technology: Surface Mount; Number of Terminals: 2; Number of Terminations: 2; Power Dissipation: 100mW; Power Rating: 100mW; REACH SVHC: Yes; Schedule B: 8533210045; Termination: SMD/SMT; Tolerance: 0.1%; Weight: 2.012816mg; Width: 800µm; Working Voltage: 75V; ComponentLink1URL: https://datasheet.octopart.com:443/RG1608P-104-B-T5-Susumu-datasheet-182148308.pdf?src-supplier=IHS; ComponentLink1Description: https://datasheet.octopart.com:443/RG1608P-104-B-T5-Susumu-datasheet-182148308.pdf?src-supplier=IHS; ComponentLink2URL: https://datasheet.octopart.com:443/RG1608P-104-B-T5-Susumu-datasheet-104167497.pdf?src-supplier=Upverter; ComponentLink2Description: https://datasheet.octopart.com:443/RG1608P-104-B-T5-Susumu-datasheet-104167497.pdf?src-supplier=Upverter; ComponentLink3URL: https://datasheet.octopart.com:443/RG1608P-104-B-T5-Susumu-datasheet-68296037.pdf?src-supplier=Future+Electronics; ComponentLink3Description: https://datasheet.octopart.com:443/RG1608P-104-B-T5-Susumu-datasheet-68296037.pdf?src-supplier=Future+Electronics; ComponentLink4URL: https://datasheet.octopart.com:443/RG1608P-104-B-T5-Susumu-datasheet-12510102.pdf?src-supplier=Future+Electronics; ComponentLink4Description: https://datasheet.octopart.com:443/RG1608P-104-B-T5-Susumu-datasheet-12510102.pdf?src-supplier=Future+Electronics; ComponentLink5URL: https://datasheet.octopart.com:443/RG1608P-104-B-T5-Susumu-datasheet-12510050.pdf?src-supplier=Future+Electronics; ComponentLink5Description: https://datasheet.octopart.com:443/RG1608P-104-B-T5-Susumu-datasheet-12510050.pdf?src-supplier=Future+Electronics; ComponentLink6URL: https://datasheet.octopart.com/RG1608P-104-B-T5-Susumu-datasheet-12509734.pdf; ComponentLink6Description: https://datasheet.octopart.com/RG1608P-104-B-T5-Susumu-datasheet-12509734.pdf; ComponentLink7URL: https://datasheet.octopart.com:443/RG1608P-104-B-T5-Susumu-datasheet-118552.pdf?src-supplier=DigiKey; ComponentLink7Description: https://datasheet.octopart.com:443/RG1608P-104-B-T5-Susumu-datasheet-118552.pdf?src-supplier=DigiKey
R35-R46 = RES 100 OHM 1/10W 0603: 100 Ohms ±0.1% 0.1W, 1/10W Chip Resistor 0603 (1608 Metric) Anti-Sulfur, Automotive AEC-Q200 Thin Film; Manufacturer: Susumu; Max Power Dissipation: 100mW; Temperature Coefficient: 25ppm/°C; Voltage Rating: 100V; Voltage Rating (DC): 75V; Supplier: Farnell; Supplier Part Number: 2930963; Manufacturer Part Number: RG1608P-101-B-T5; RoHS: Compliant; Category: Chip SMD Resistors; Stock: 4117; Pricing: 1=0,095, 25=0,075, 50=0,069, 100=0,062, 250=0,056 (EUR); Case/Package: 0603; Case Code (Imperial): 0603; Case Code (Metric): 1608; Composition: Thin Film; Contact Plating: Tin; Features: Automotive AEC-Q200; Height: 400µm; Lead Free: Lead Free; Length: 1.6002mm; Lifecycle Status: Production; Max Operating Temperature: 155°C; Min Operating Temperature: -55°C; Mounting Technology: Surface Mount; Pins: 2; Number of Terminals: 2; Number of Terminations: 2; Packaging: Tape & Reel; Power Dissipation: 100mW; Power Rating: 100mW; REACH SVHC: Yes; Termination: SMD/SMT; Tolerance: 0.1%; Width: 800µm; Working Voltage: 100V; ComponentLink1URL: https://datasheet.octopart.com:443/RG1608P-101-B-T5-Susumu-datasheet-182148308.pdf?src-supplier=IHS; ComponentLink1Description: https://datasheet.octopart.com:443/RG1608P-101-B-T5-Susumu-datasheet-182148308.pdf?src-supplier=IHS; ComponentLink2URL: https://datasheet.octopart.com:443/RG1608P-101-B-T5-Susumu-datasheet-104167497.pdf?src-supplier=Upverter; ComponentLink2Description: https://datasheet.octopart.com:443/RG1608P-101-B-T5-Susumu-datasheet-104167497.pdf?src-supplier=Upverter; ComponentLink3URL: https://datasheet.octopart.com:443/RG1608P-101-B-T5-Susumu-datasheet-78834969.pdf?src-supplier=Farnell; ComponentLink3Description: https://datasheet.octopart.com:443/RG1608P-101-B-T5-Susumu-datasheet-78834969.pdf?src-supplier=Farnell; ComponentLink4URL: https://datasheet.octopart.com:443/RG1608P-101-B-T5-Susumu-datasheet-12509734.pdf?src-supplier=Future+Electronics; ComponentLink4Description: https://datasheet.octopart.com:443/RG1608P-101-B-T5-Susumu-datasheet-12509734.pdf?src-supplier=Future+Electronics; ComponentLink5URL: https://datasheet.octopart.com:443/RG1608P-101-B-T5-Susumu-datasheet-12510102.pdf?src-supplier=Future+Electronics; ComponentLink5Description: https://datasheet.octopart.com:443/RG1608P-101-B-T5-Susumu-datasheet-12510102.pdf?src-supplier=Future+Electronics; ComponentLink6URL: https://datasheet.octopart.com:443/RG1608P-101-B-T5-Susumu-datasheet-12510050.pdf?src-supplier=Future+Electronics; ComponentLink6Description: https://datasheet.octopart.com:443/RG1608P-101-B-T5-Susumu-datasheet-12510050.pdf?src-supplier=Future+Electronics; ComponentLink7URL: https://datasheet.octopart.com:443/RG1608P-101-B-T5-Susumu-datasheet-8324184.pdf?src-supplier=Newark; ComponentLink7Description: https://datasheet.octopart.com:443/RG1608P-101-B-T5-Susumu-datasheet-8324184.pdf?src-supplier=Newark; ComponentLink8URL: https://datasheet.octopart.com:443/RG1608P-101-B-T5-Susumu-datasheet-118552.pdf?src-supplier=DigiKey; ComponentLink8Description: https://datasheet.octopart.com:443/RG1608P-101-B-T5-Susumu-datasheet-118552.pdf?src-supplier=DigiKey
U8 = BQ7692000PW: 3 to 5-Series Cell Li-Ion and Li-Phosphate Battery Monitor (bq76940 Family) 20-TSSOP -40 to 85; Manufacturer: Texas Instruments; Manufacturer Lifecycle Status: ACTIVE; Fault Protection: Over Current, Over/Under Voltage, Short Circuit; Interface: I2C; Max Supply Voltage: 25V; Min Supply Voltage: 6V; Number of Cells: 5; Output Voltage: 3.6V; Supplier: Mouser; Manufacturer Part Number: BQ7692000PWR; RoHS: Compliant; Category: Battery Management; Stock: 2559; Pricing: 1=3,56, 10=2,68, 50=2,46, 100=2,21, 1000=1,97, 10000=1,87 (USD); Case/Package: TSSOP; Contact Plating: Gold; Height: 0m; Lead Free: Lead Free; Length: 6.5mm; Lifecycle Status: Production; Max Operating Temperature: 85°C; Min Operating Temperature: -40°C; Mounting Technology: Surface Mount; Pins: 20; Packaging: Tape & Reel (TR); Thickness: 1mm; Weight: 78.187985mg; Width: 4.4mm; ComponentLink1URL: https://sigma.octopart.com:443/157851284/technical_drawing/Texas-Instruments-BQ7692000PWR.pdf?src-supplier=Texas+Instruments; ComponentLink1Description: https://sigma.octopart.com:443/157851284/technical_drawing/Texas-Instruments-BQ7692000PWR.pdf?src-supplier=Texas+Instruments; ComponentLink2URL: https://octopart.com:443/opatz8j6/c1?t=SUv5cTV3hbxgLzMURFhOl31P7KwdP4IIa1VXY-0LQTF56ovuquQhRah-IZMqMMYwmg_DfMuMoPnfRi3b6zabcyTbO33mx1nQz2bkJkMKHm8q09abDQSYb_WkrLjav2RMt-V5NjDpR6hn6fR69isqLRegOjoVb3BuvhuEuIC9qftM-JVDlkyISEQycX9rjI5xR09KPbL3ewCdJCialcWofIxbjuTWOTvIVVdEzCEQW0iyRmTiOXLILS7qWjAwphNZ1e-U7mh07FngErzhP7Mb2cWrE7io9jCloFUrM_r23Ys53kEe01IhFn4WIjfFAp6eArI68kZDZimviBPFZOzgamDubAsPha5UrIwXwr63rUMxCzXOMdaU3E7royDoSUAaeIRbPQ&src-supplier=Texas+Instruments; ComponentLink2Description: https://octopart.com:443/opatz8j6/c1?t=SUv5cTV3hbxgLzMURFhOl31P7KwdP4IIa1VXY-0LQTF56ovuquQhRah-IZMqMMYwmg_DfMuMoPnfRi3b6zabcyTbO33mx1nQz2bkJkMKHm8q09abDQSYb_WkrLjav2RMt-V5NjDpR6hn6fR69isqLRegOjoVb3BuvhuEuIC9qftM-JVDlkyISEQycX9rjI5xR09KPbL3ewCdJCialcWofIxbjuTWOTvIVVdEzCEQW0iyRmTiOXLILS7qWjAwphNZ1e-U7mh07FngErzhP7Mb2cWrE7io9jCloFUrM_r23Ys53kEe01IhFn4WIjfFAp6eArI68kZDZimviBPFZOzgamDubAsPha5UrIwXwr63rUMxCzXOMdaU3E7royDoSUAaeIRbPQ&src-supplier=Texas+Instruments; ComponentLink3URL: https://datasheet.octopart.com:443/BQ7692000PWR-Texas-Instruments-datasheet-34142074.pdf?src-supplier=Texas+Instruments; ComponentLink3Description: https://datasheet.octopart.com:443/BQ7692000PWR-Texas-Instruments-datasheet-34142074.pdf?src-supplier=Texas+Instruments; ComponentLink4URL: https://datasheet.octopart.com:443/BQ7692000PWR-Texas-Instruments-datasheet-32015107.pdf?src-supplier=Texas+Instruments; ComponentLink4Description: https://datasheet.octopart.com:443/BQ7692000PWR-Texas-Instruments-datasheet-32015107.pdf?src-supplier=Texas+Instruments; ComponentLink5URL: https://datasheet.octopart.com:443/BQ7692000PWR-Texas-Instruments-datasheet-24998011.pdf?src-supplier=Texas+Instruments; ComponentLink5Description: https://datasheet.octopart.com:443/BQ7692000PWR-Texas-Instruments-datasheet-24998011.pdf?src-supplier=Texas+Instruments; ComponentLink6URL: https://sigma.octopart.com:443/49249835/technical_drawing/Texas-Instruments-BQ7692000PWR.pdf?src-supplier=Texas+Instruments; ComponentLink6Description: https://sigma.octopart.com:443/49249835/technical_drawing/Texas-Instruments-BQ7692000PWR.pdf?src-supplier=Texas+Instruments; ComponentLink7URL: https://datasheet.octopart.com:443/BQ7692000PWR-Texas-Instruments-datasheet-149901685.pdf?src-supplier=Upverter; ComponentLink7Description: https://datasheet.octopart.com:443/BQ7692000PWR-Texas-Instruments-datasheet-149901685.pdf?src-supplier=Upverter; ComponentLink8URL: https://datasheet.octopart.com:443/BQ7692000PWR-Texas-Instruments-datasheet-162168029.pdf?src-supplier=LCSC; ComponentLink8Description: https://datasheet.octopart.com:443/BQ7692000PWR-Texas-Instruments-datasheet-162168029.pdf?src-supplier=LCSC; ComponentLink9URL: https://datasheet.octopart.com:443/BQ7692000PWR-Texas-Instruments-datasheet-164413110.pdf?src-supplier=SHENGYU+ELECTRONICS; ComponentLink9Description: https://datasheet.octopart.com:443/BQ7692000PWR-Texas-Instruments-datasheet-164413110.pdf?src-supplier=SHENGYU+ELECTRONICS; ComponentLink10URL: http://sigma.octopart.com:80/conflict_mineral_statement/Texas-Instruments-company-63.pdf?src-supplier=Compliance+Statements; ComponentLink10Description: http://sigma.octopart.com:80/conflict_mineral_statement/Texas-Instruments-company-63.pdf?src-supplier=Compliance+Statements; ComponentLink11URL: http://sigma.octopart.com:80/reach_statement/Texas-Instruments-company-64.pdf?src-supplier=Compliance+Statements; ComponentLink11Description: http://sigma.octopart.com:80/reach_statement/Texas-Instruments-company-64.pdf?src-supplier=Compliance+Statements